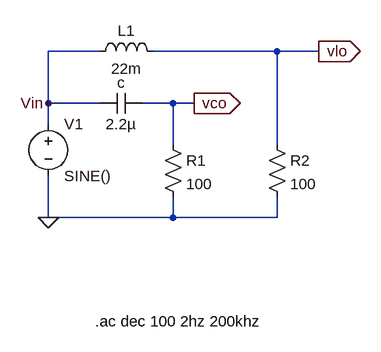
[diagram p0: schematic passive filters.asc]
passive filters.asc, the LTspice schematic file:
Version 4
SHEET 1 880 680
WIRE 240 144 160 144
WIRE 512 144 320 144
WIRE 576 144 512 144
WIRE 160 224 160 144
WIRE 240 224 160 224
WIRE 352 224 304 224
WIRE 384 224 352 224
WIRE 160 256 160 224
WIRE 352 288 352 224
WIRE 512 288 512 144
WIRE 160 400 160 336
WIRE 352 400 352 368
WIRE 352 400 160 400
WIRE 512 400 512 368
WIRE 512 400 352 400
FLAG 384 224 vco
IOPIN 384 224 Out
FLAG 576 144 vlo
IOPIN 576 144 Out
FLAG 160 400 0
FLAG 160 224 Vin
SYMBOL voltage 160 240 R0
SYMATTR InstName V1
SYMATTR Value SINE()
SYMATTR Value2 AC 3v
SYMBOL cap 304 208 R90
WINDOW 0 0 32 VBottom 2
WINDOW 3 32 32 VTop 2
SYMATTR InstName c
SYMATTR Value 2.2µ
SYMBOL ind 224 160 R270
WINDOW 0 32 56 VTop 2
WINDOW 3 5 56 VBottom 2
SYMATTR InstName L1
SYMATTR Value 22m
SYMATTR SpiceLine Ipk=190m Rser=14.448 Rpar=2.0724Meg Cpar=0 mfg="Coilcraft" pn="PCH-45X-226"
SYMBOL res 336 272 R0
SYMATTR InstName R1
SYMATTR Value 100
SYMBOL res 496 272 R0
SYMATTR InstName R2
SYMATTR Value 100
TEXT 232 560 Left 2 !.ac dec 100 2hz 200khz

The netlist it stands for:
* passive filters.asc
V1 Vin 0 SINE() AC 3v
c vco Vin 2.2µ
L1 Vin vlo 22m Ipk=190m Rser=14.448 Rpar=2.0724Meg Cpar=0 mfg="Coilcraft" pn="PCH-45X-226"
R1 vco 0 100
R2 vlo 0 100
.ac dec 100 2hz 200khz
.backanno
.end